# Altium schematic sheet user_interface.SchDoc: User interface
size 297 x 209 mm; CheckedBy: MC, TW, EB; CompanyName: CERN; DrawnBy: Greg Kasprowicz; Organization: CERN; Address1: European Organization for Nuclear Research; Address2: CH-1211 Genиve 23 - Switzerland; DocumentNumber: 17; Revision: -; SheetNumber: 17; SheetTotal: 17; EDA_Number: EDA-02189-V4-0; Projet: Simple PCIe Carrier Board; ModifiedBy: TW, MC; CreateDate: 10/07/2010; CheckedDate: 11/05/2011; Title2: USB UART, buttons, LEDs; DivGrp: BE-CO; Designer: GK, MC, TW, EB, PAS; ModifiedDate: -
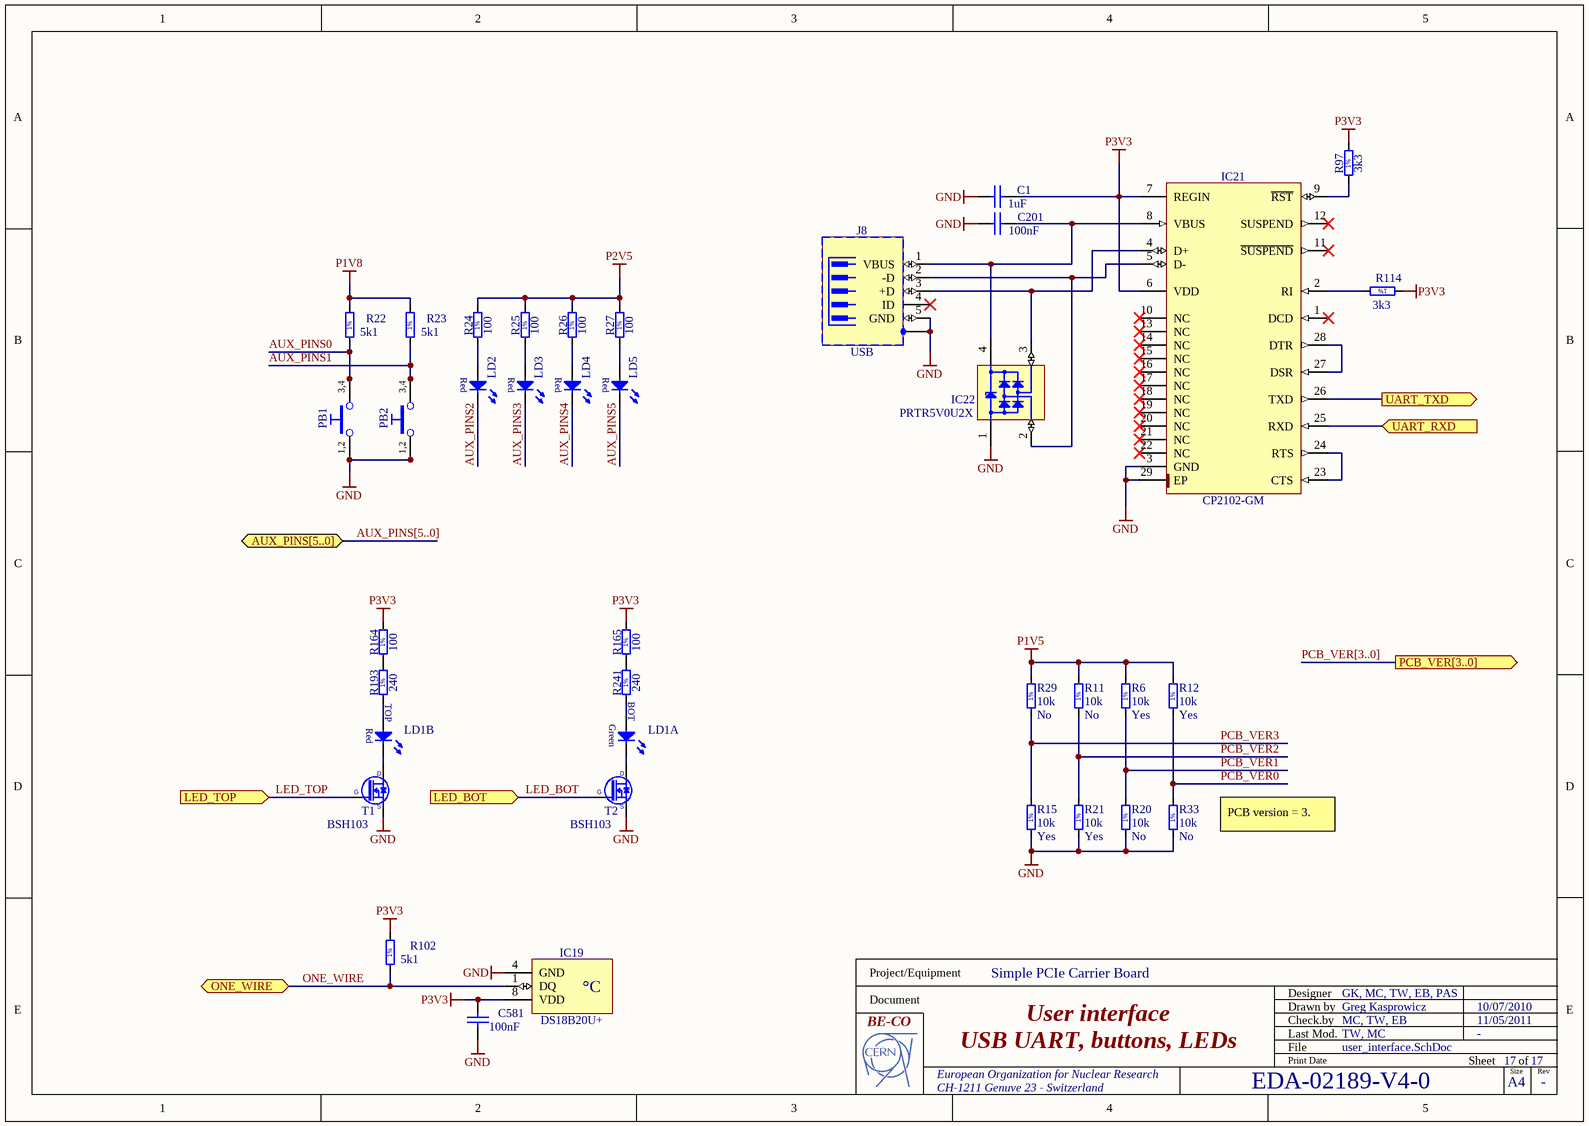
[diagram p0: user_interface.SchDoc]

## Parts
C1  1uF  [CAPC1608X87N]
C201  100nF  [CAPC1608X87N]
C581  100nF  [CAPC1608X87N]
IC19  DS18B20U+  [SOP65P490X110-8N]
IC21  CP2102-GM  [QFN50P500X500X100-29N-S335]
IC22  PRTR5V0U2X  [SOT190P230X110-4N]
J8  USB  [TYCO_1734035-1]
LD1  Red/Green  [LED_DIALIGHT_571-0112F]  (value not drawn)  (parts A,B of 2)
LD2  Red  [LEDC1608X80N_RED]  (value not drawn)
LD3  Red  [LEDC1608X80N_RED]  (value not drawn)
LD4  Red  [LEDC1608X80N_RED]  (value not drawn)
LD5  Red  [LEDC1608X80N_RED]  (value not drawn)
PB1  Push Button  [PB_TYCO_ALCOSWITCH_FSM2JSMA]  (value not drawn)
PB2  Push Button  [PB_TYCO_ALCOSWITCH_FSM2JSMA]  (value not drawn)
R6  10k  Mounted: Yes  [RESC1608X55N]
R11  10k  Mounted: No  [RESC1608X55N]
R12  10k  Mounted: Yes  [RESC1608X55N]
R15  10k  Mounted: Yes  [RESC1608X55N]
R20  10k  Mounted: No  [RESC1608X55N]
R21  10k  Mounted: Yes  [RESC1608X55N]
R22  5k1  [RESC1608X55N]
R23  5k1  [RESC1608X55N]
R24  100  [RESC1608X55N]
R25  100  [RESC1608X55N]
R26  100  [RESC1608X55N]
R27  100  [RESC1608X55N]
R29  10k  Mounted: No  [RESC1608X55N]
R33  10k  Mounted: No  [RESC1608X55N]
R97  3k3  [RESC1608X55N]
R102  5k1  [RESC1608X55N]
R114  3k3  [RESC1608X55N]
R164  100  [RESC1608X55N]
R165  100  [RESC1608X55N]
R193  240  [RESC1608X55N]
R241  240  [RESC1608X55N]
T1  BSH103  [SOT95P230X110-3N]
T2  BSH103  [SOT95P230X110-3N]

## Ports
AUX_PINS[5..0] (bidir), LED_BOT (in), LED_TOP (in), ONE_WIRE (bidir), PCB_VER[3..0] (out), UART_RXD (in), UART_TXD (out)

## Nets
GND: C1.2 C201.2 C581.2 IC19.4(GND) IC21.3(GND) IC21.29(EP) IC22.1(GND) J8.5(GND) J8.6(SH) PB1.1 PB1.2 PB2.1 PB2.2 R15.1 R20.1 R21.1 R33.1 T1.2(S) T2.2(S)
P1V5: R6.2 R11.2 R12.2 R29.2
P1V8: R22.2 R23.2
P2V5: R24.2 R25.2 R26.2 R27.2
P3V3: C1.1 C581.1 IC19.8(VDD) IC21.6(VDD) IC21.7(REGIN) R97.2 R102.2 R114.1 R164.2 R165.2
AUX_PINS0: PB1.3 PB1.4 R22.1
AUX_PINS1: PB2.3 PB2.4 R23.1
AUX_PINS2: LD2.1(C)
AUX_PINS3: LD3.1(C)
AUX_PINS4: LD4.1(C)
AUX_PINS5: LD5.1(C)
LED_BOT: T2.1(G) ; port LED_BOT
LED_TOP: T1.1(G) ; port LED_TOP
ONE_WIRE: IC19.1(DQ) R102.1 ; port ONE_WIRE
PCB_VER0: R12.1 R33.2
PCB_VER1: R6.1 R20.2
PCB_VER2: R11.1 R21.2
PCB_VER3: R15.2 R29.1
UART_RXD: IC21.25(RXD) ; port UART_RXD
UART_TXD: IC21.26(TXD) ; port UART_TXD
NetC201_1: C201.1 IC21.8(VBUS) IC22.4(VCC) J8.1(VBUS)
NetIC21_2: IC21.2(RI) R114.2
NetIC21_4: IC21.4(D+) IC22.3(I/O2) J8.3(+D)
NetIC21_5: IC21.5(D-) IC22.2(I/O1) J8.2(-D)
NetIC21_9: IC21.9(~{RST}) R97.1
NetIC21_23: IC21.23(CTS) IC21.24(RTS)
NetIC21_27: IC21.27(DSR) IC21.28(DTR)
NetLD1_1: LD1.1(C) T2.3(D)
NetLD1_2: LD1.2(A) R241.1
NetLD1_3: LD1.3(C) T1.3(D)
NetLD1_4: LD1.4(A) R193.1
NetLD2_2: LD2.2(A) R24.1
NetLD3_2: LD3.2(A) R25.1
NetLD4_2: LD4.2(A) R26.1
NetLD5_2: LD5.2(A) R27.1
NetR164_1: R164.1 R193.2
NetR165_1: R165.1 R241.2

Not connected (* = marked no-connect by the designer): IC21 1(DCD)* 10(NC)* 11(~{SUSPEND})* 12(SUSPEND)* 13(NC)* 14(NC)* 15(NC)* 16(NC)* 17(NC)* 18(NC)* 19(NC)* 20(NC)* 21(NC)* 22(NC)*; J8 4(ID)*

## Buses and harness runs
bus AUX_PINS[5..0] = port AUX_PINS[5..0]
bus PCB_VER[3..0] = port PCB_VER[3..0]

## Notes on the sheet
- (near R33) PCB version = 3.
- Project/Equipment
- Document
- Designer
- Drawn by
- Check.by
- File
- Last Mod.
- Print Date
- Sheet
- Size
- A4
- of
- Rev
- (in symbol DS18B20U+) °C
- (in symbol LED_DIALIGHT_571-0112F, part A) BOT; Green
- (in symbol LED_DIALIGHT_571-0112F, part B) TOP; Red
- (in symbol PB_TYCO_ALCOSWITCH_FSM2JSMA) 3,4; 1,2
- (in symbol R0603_3K3_1%_0.1W_100PPM) 1%
- (in symbol R0603_5K1_1%_0.1W_100PPM) 1%
- (in symbol R0603_10K_1%_0.1W_100PPM) 1%
- (in symbol R0603_100R_1%_0.1W_100PPM) 1%
- (in symbol R0603_240R_1%_0.1W_100PPM) 1%

## Library data of the parts
C1 = CC0603_1UF_16V_10%_X7R: Non-polarised capacitor; Part Description: SMD Multilayer Chip Ceramic Capacitor; Manufacturer: GENERIC; Manufacturer1 Part Number: 223824613663; Voltage: 16V; TC: X7R; Tolerance: ±10%; Table: Capacitors SMD; Part Number: CC0603_1UF_16V_10%_X7R; Component Kind: Standard; Component Type: Standard; Pin Count: 2; Value: 1uF; Status: Preferred; Manufacturer Part Number: CC0603_1uF_16V_10%_X7R; Case: 0603; Mounted: Yes; Socket: No; SMD: Yes; Manufacturer1 Example: PHYCOMP; Manufacturer1 ComponentHeight: 0.87mm; HelpURL: \\cern.ch\dfs\Applications\Altium\Datasheets\CC0805_X5R_PHYCOMP_HC.pdf; Author: CERN DEM JLC; CreateDate: 12/3/2007; LatestRevisionDate: 12/3/2007
C201 C581 = CC0603_100NF_50V_10%_X7R: Non-polarised capacitor; Part Description: SMD Multilayer Chip Ceramic Capacitor; Manufacturer: GENERIC; Manufacturer1 Part Number: 223858615649; Voltage: 50V; TC: X7R; Tolerance: ±10%; Table: Capacitors SMD; Part Number: CC0603_100NF_50V_10%_X7R; Component Kind: Standard; Component Type: Standard; Pin Count: 2; Value: 100nF; Status: Preferred; Manufacturer Part Number: CC0603_100NF_50V_10%_X7R; Case: 0603; Mounted: Yes; Socket: No; SMD: Yes; Manufacturer1 Example: PHYCOMP; Manufacturer1 ComponentHeight: 0.87mm; HelpURL: \\cern.ch\dfs\Applications\Altium\Datasheets\CC0603_X7R_PHYCOMP.pdf; Author: CERN DEM JLC; CreateDate: 03/12/2007; LatestRevisionDate: 03/12/2007
IC19 = DS18B20U+: Programmable Resolution 1-Wire Digital Thermometer; Part Description: Programmable Resolution 1-Wire Digital Thermometer (-55°C to +125°C); Manufacturer: DALLAS MAXIM; Table: Sensors; Part Number: DS18B20U+; Component Kind: Standard; Component Type: Standard; Device: DS18B20U+; PackageDescription: SOP, 0.65mm pitch; 8 pin, 3.00mm W X 3.00mm L X 1.10mm H body, IPC Medium Density; Manufacturer Part Number: DS18B20U+; Pin Count: 3; Case: uSOP8; Mounted: Yes; Socket: No; SMD: Yes; ComponentHeight: 1.1mm; HelpURL: \\cern.ch\dfs\Applications\Altium\Datasheets\DS18B20U+.pdf; Author: CERN DEM JLC; CreateDate: 3/17/2010; LatestRevisionDate: 5/2/2011
IC21 = CP2102-GM: Single-Chip USB to UART Bridge; Manufacturer: SILICON LABS; Table: Analog & Interface; Part Number: CP2102-GM; Component Kind: Standard; Component Type: Standard; Device: CP2102-GM; PackageDescription: QFN, 0.50mm Pitch, Square; 28 pin, 5.00mm L X 5.00mm W X 1.00mm H body (w/thermal tab 3.35 X 3.35mm),  IPC Medium Density; Part Description: Single-Chip USB to UART Bridge; Manufacturer Part Number: CP2102-GM; Pin Count: 29; Case: QFN28; Mounted: Yes; Socket: No; SMD: Yes; ComponentHeight: 1.0mm; Author: CERN DEM JLC; HelpURL: \\cern.ch\dfs\Applications\Altium\Datasheets\CP2102-GM.pdf; CreateDate: 3/3/2011; LatestRevisionDate: 3/3/2011
IC22 = PRTR5V0U2X: Ultra Low Capacitance Double Rail-to-Rail ESD Protection Diode; Part Description: Ultra Low Capacitance (1pF) Double Rail-to-Rail ESD Protection Diode (8kV); Manufacturer: PHILIPS NXP; Voltage: 5.5V; Table: Diodes; Part Number: PRTR5V0U2X; Component Kind: Standard; Component Type: Standard; Device: PRTR5V0U2X; PackageDescription: SOT143B, SOT, 1.90mm Pitch; 4 Pin, 1.30mm W X 2.90mm L X 1.10mm H body, IPC Medium Density; Manufacturer Part Number: PRTR5V0U2X; Pin Count: 4; Case: SOT143B; Mounted: Yes; Socket: No; SMD: Yes; ComponentHeight: 1.1mm; HelpURL: \\cern.ch\dfs\Applications\Altium\Datasheets\PRTR5V0U2X.pdf; Author: CERN DEM JLC; CreateDate: 3/22/2011; LatestRevisionDate: 3/22/2011
J8 = TYCO_1734035-1: 5 Pin + 1 Shield USB Receptacle; Part Description: 5 Position, Right Angle, SMD Mini USB Type B Receptacle; Manufacturer: TYCO ELECTRONICS; Table: TYCO; Part Number: TYCO_1734035-1; Component Kind: Standard; Component Type: Standard; Pin Count: 6; Family: USB; Mounted: Yes; Socket: No; SMD: Yes; Status: None; Manufacturer Part Number: 1734035-1; ComponentHeight: 3.95mm; HelpURL: \\cern.ch\dfs\Applications\Altium\Datasheets\TYCO_1734035-1.pdf; Author: CERN DEM JLC; CreateDate: 02/05/2011; LatestRevisionDate: 02/05/2011
LD1 = LED_DIALIGHT_571-0112F: 2x LED  Botom Green, Top Red; Part Description: Dual 2mm  LEDs, Red Top,Green Bot, CBI® Circuit Board Indicator (Without positioning pins); Table: LEDs & Displays; Part Number: LED_DIALIGHT_571-0112F; Component Kind: Standard; Component Type: Standard; Color: Red/Green; PackageDescription: 2x 2mm LED (Top: Red, Bot: Green) PCB Edge Mounting (Without positioning pins) DIALIGHT 571 Serie; Manufacturer: DIALIGHT; Manufacturer Part Number: 571-0112F; Pin Count: 4; Mounted: Yes; Socket: No; SMD: No; ComponentHeight: 8.6mm; HelpURL: \\cern.ch\dfs\Applications\Altium\Datasheets\LED_DIALIGHT_571-0112F.pdf; Author: CERN DEM JLC; CreateDate: 09/11/2009; LatestRevisionDate: 17/03/2010
LD2-LD5 = LED_ROHM_SML-311UTT86K: LED Red 1C 2A; Part Description: Low current chip LED SML-311 Serie; Manufacturer: ROHM; Table: LEDs & Displays; Part Number: LED_ROHM_SML-311UTT86K; Component Kind: Standard; Component Type: Standard; Color: Red; PackageDescription: Chip Red LED, 2-Leads, Body 1.6x0.8mm, IPC Medium Density; Manufacturer Part Number: SML-311UTT86K; Pin Count: 2; Mounted: Yes; Socket: No; SMD: Yes; ComponentHeight: 0.8mm; HelpURL: \\cern.ch\dfs\Applications\Altium\Datasheets\LED_ROHM_SML-311UTT86K.pdf; Author: CERN DEM JLC; CreateDate: 3/16/2010; LatestRevisionDate: 3/17/2010
PB1 PB2 = PB_TYCO_ALCOSWITCH_FSM2JSMA: Push-Button Switch SPDT; Part Description: 12VDC 50mA SPST Tactile  Push-Button Switch; Manufacturer: TYCO ALCOSWITCH; Manufacturer Part Number: FSM2JSMA or  2-1437565-7; Table: Switches; Part Number: PB_TYCO_ALCOSWITCH_FSM2JSMA; Component Kind: Standard; Component Type: Standard; Pin Count: 4; PackageDescription: Body 6mm x 6mm, Surface Mount Tactile Switches, TYCO ALCOSWITCH FSMJSMA Series; Family: Push Button; Mounted: Yes; Socket: No; SMD: Yes; Status: None; ComponentHeight: 4.59mm; HelpURL: \\cern.ch\dfs\Applications\Altium\Datasheets\PB_TYCO_ALCOSWITCH_FSM2JSMA.pdf; Author: CERN DEM JLC; CreateDate: 2008-09-08; LatestRevisionDate: 2009-08-31
R6 R11 R12 R15 R20 R21 R29 R33 = R0603_10K_1%_0.1W_100PPM: Resistor - 1%; Part Description: General Purpose Thick Film Chip Resistor; Manufacturer: GENERIC; Manufacturer1 Part Number: NRC06F1002TRF; Power: 0.1W; TC: ±100ppm/°C; Table: Resistors SMD; Part Number: R0603_10K_1%_0.1W_100PPM; Component Kind: Standard; Component Type: Standard; Pin Count: 2; Value: 10k; Status: Preferred; Tolerance: ±1%; Manufacturer Part Number: R0603_10K_1%_0.1W_100PPM; Case: 0603; Socket: No; SMD: Yes; Manufacturer1 Example: NIC COMPONENT; Manufacturer1 ComponentHeight: 0.55mm; HelpURL: \\cern.ch\dfs\Applications\Altium\Datasheets\R0603_NIC_NRC.pdf; Author: CERN DEM JLC; CreateDate: 12/3/2007; LatestRevisionDate: 3/13/2008
R22 R23 R102 = R0603_5K1_1%_0.1W_100PPM: Resistor - 1%; Part Description: General Purpose Thick Film Chip Resistor; Manufacturer: GENERIC; Manufacturer1 Part Number: NRC06F5101TRF; Power: 0.1W; TC: ±100ppm/°C; Table: Resistors SMD; Part Number: R0603_5K1_1%_0.1W_100PPM; Component Kind: Standard; Component Type: Standard; Pin Count: 2; Value: 5k1; Status: Preferred; Tolerance: ±1%; Manufacturer Part Number: R0603_5K1_1%_0.1W_100PPM; Case: 0603; Mounted: Yes; Socket: No; SMD: Yes; Manufacturer1 Example: NIC COMPONENT; Manufacturer1 ComponentHeight: 0.55mm; HelpURL: \\cern.ch\dfs\Applications\Altium\Datasheets\R0603_NIC_NRC.pdf; Author: CERN DEM JLC; CreateDate: 03/12/2007; LatestRevisionDate: 13/03/2008
R24-R27 R164 R165 = R0603_100R_1%_0.1W_100PPM: Resistor - 1%; Part Description: General Purpose Thick Film Chip Resistor; Manufacturer: GENERIC; Manufacturer1 Part Number: NRC06F4700TRF; Power: 0.1W; TC: ±100ppm/°C; Table: Resistors SMD; Part Number: R0603_100R_1%_0.1W_100PPM; Component Kind: Standard; Component Type: Standard; Pin Count: 2; Value: 100; Status: Preferred; Tolerance: ±1%; Manufacturer Part Number: R0603_100R_1%_0.1W_100PPM; Case: 0603; Mounted: Yes; Socket: No; SMD: Yes; Manufacturer1 Example: NIC COMPONENT; Manufacturer1 ComponentHeight: 0.55mm; HelpURL: \\cern.ch\dfs\Applications\Altium\Datasheets\R0603_NIC_NRC.pdf; Author: CERN DEM JLC; CreateDate: 12/3/2007; LatestRevisionDate: 3/13/2008
R97 R114 = R0603_3K3_1%_0.1W_100PPM: Resistor - 1%; Part Description: General Purpose Thick Film Chip Resistor; Manufacturer: GENERIC; Manufacturer1 Part Number: NRC06F3301TRF; Power: 0.1W; TC: ±100ppm/°C; Table: Resistors SMD; Part Number: R0603_3K3_1%_0.1W_100PPM; Component Kind: Standard; Component Type: Standard; Pin Count: 2; Value: 3k3; Status: Preferred; Tolerance: ±1%; Manufacturer Part Number: R0603_3K3_1%_0.1W_100PPM; Case: 0603; Mounted: Yes; Socket: No; SMD: Yes; Manufacturer1 Example: NIC COMPONENT; Manufacturer1 ComponentHeight: 0.55mm; HelpURL: \\cern.ch\dfs\Applications\Altium\Datasheets\R0603_NIC_NRC.pdf; Author: CERN DEM JLC; CreateDate: 12/3/2007; LatestRevisionDate: 3/13/2008
R193 R241 = R0603_240R_1%_0.1W_100PPM: Resistor - 1%; Part Description: General Purpose Thick Film Chip Resistor; Manufacturer: GENERIC; Manufacturer1 Part Number: NRC06F2400TRF; Power: 0.1W; TC: ±100ppm/°C; Table: Resistors SMD; Part Number: R0603_240R_1%_0.1W_100PPM; Component Kind: Standard; Component Type: Standard; Pin Count: 2; Value: 240; Status: Preferred; Tolerance: ±1%; Manufacturer Part Number: R0603_240R_1%_0.1W_100PPM; Case: 0603; Mounted: Yes; Socket: No; SMD: Yes; Manufacturer1 Example: NIC COMPONENT; Manufacturer1 ComponentHeight: 0.55mm; HelpURL: \\cern.ch\dfs\Applications\Altium\Datasheets\R0603_NIC_NRC.pdf; Author: CERN DEM JLC; CreateDate: 12/3/2007; LatestRevisionDate: 3/13/2008
T1 T2 = BSH103: N-CHANNEL MOSFET WITH DIODE; Part Description: 50V 200mA N-Channel Enhancement Mode Field-Effect Transistor; Manufacturer: NXP SEMICONDUCTORS; Table: Transistors; Part Number: BSH103; Component Kind: Standard; Component Type: Standard; Device: BSH103; PackageDescription: SOT23, 3 pin, Pitch 0.95mm - 1.3mm W X 2.9mm L X 1.1mm H, IPC Medium Density; Manufacturer Part Number: BSH103; Pin Count: 3; Case: SOT23-3; Mounted: Yes; Socket: No; SMD: Yes; ComponentHeight: 1.1mm; HelpURL: \\cern.ch\dfs\Applications\Altium\Datasheets\BSH103.pdf; Author: CERN DEM JLC; CreateDate: 3/16/2010; LatestRevisionDate: 3/16/2010